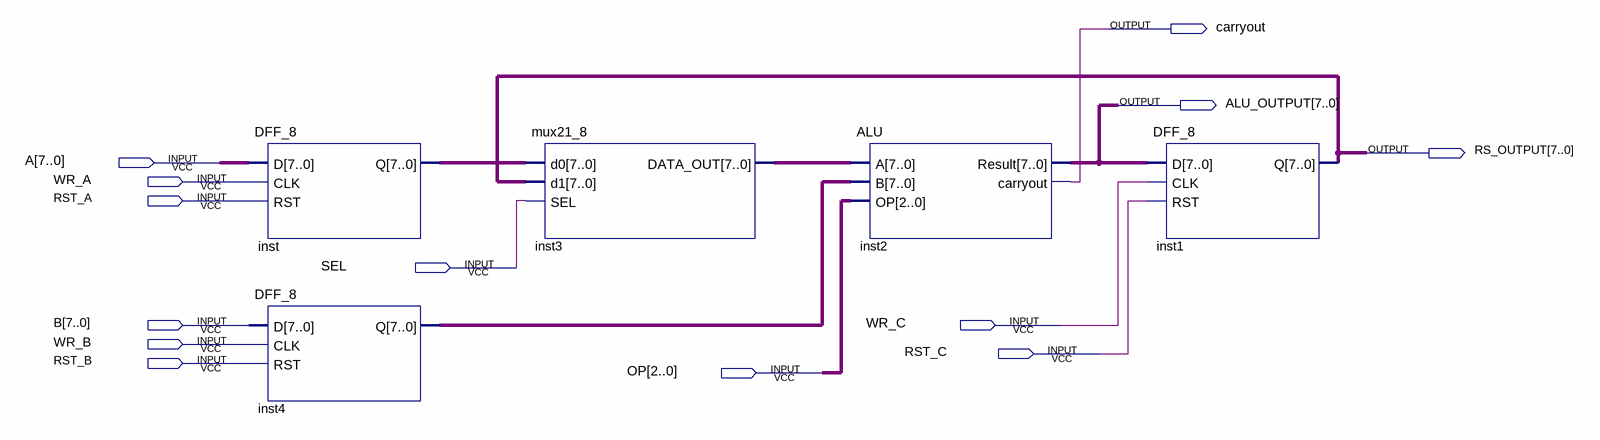
[diagram p0: schematic sheet]
// Quartus schematic alu_system.bdf as structural Verilog: 5 symbols, 13 pins
module alu_system (
  input  [7:0] A,
  input  WR_A,
  input  RST_A,
  input  SEL,
  input  [7:0] B,
  input  WR_C,
  input  WR_B,
  input  RST_C,
  input  RST_B,
  input  [2:0] OP,
  output carryout,
  output [7:0] ALU_OUTPUT,
  output [7:0] RS_OUTPUT
);

  wire [7:0] inst3_data_out, inst4_q, inst_q;

  DFF_8 inst (.D(A), .CLK(WR_A), .RST(RST_A), .Q(inst_q));
  DFF_8 inst4 (.D(B), .CLK(WR_B), .RST(RST_B), .Q(inst4_q));
  mux21_8 inst3 (.d0(inst_q), .d1(RS_OUTPUT), .SEL(SEL), .DATA_OUT(inst3_data_out));
  ALU inst2 (.A(inst3_data_out), .B(inst4_q), .OP(OP), .Result(ALU_OUTPUT), .carryout(carryout));
  DFF_8 inst1 (.D(ALU_OUTPUT), .CLK(WR_C), .RST(RST_C), .Q(RS_OUTPUT));
endmodule
